# EAGLE design Multi Room Fire Detection (EAGLE 9.6.2)
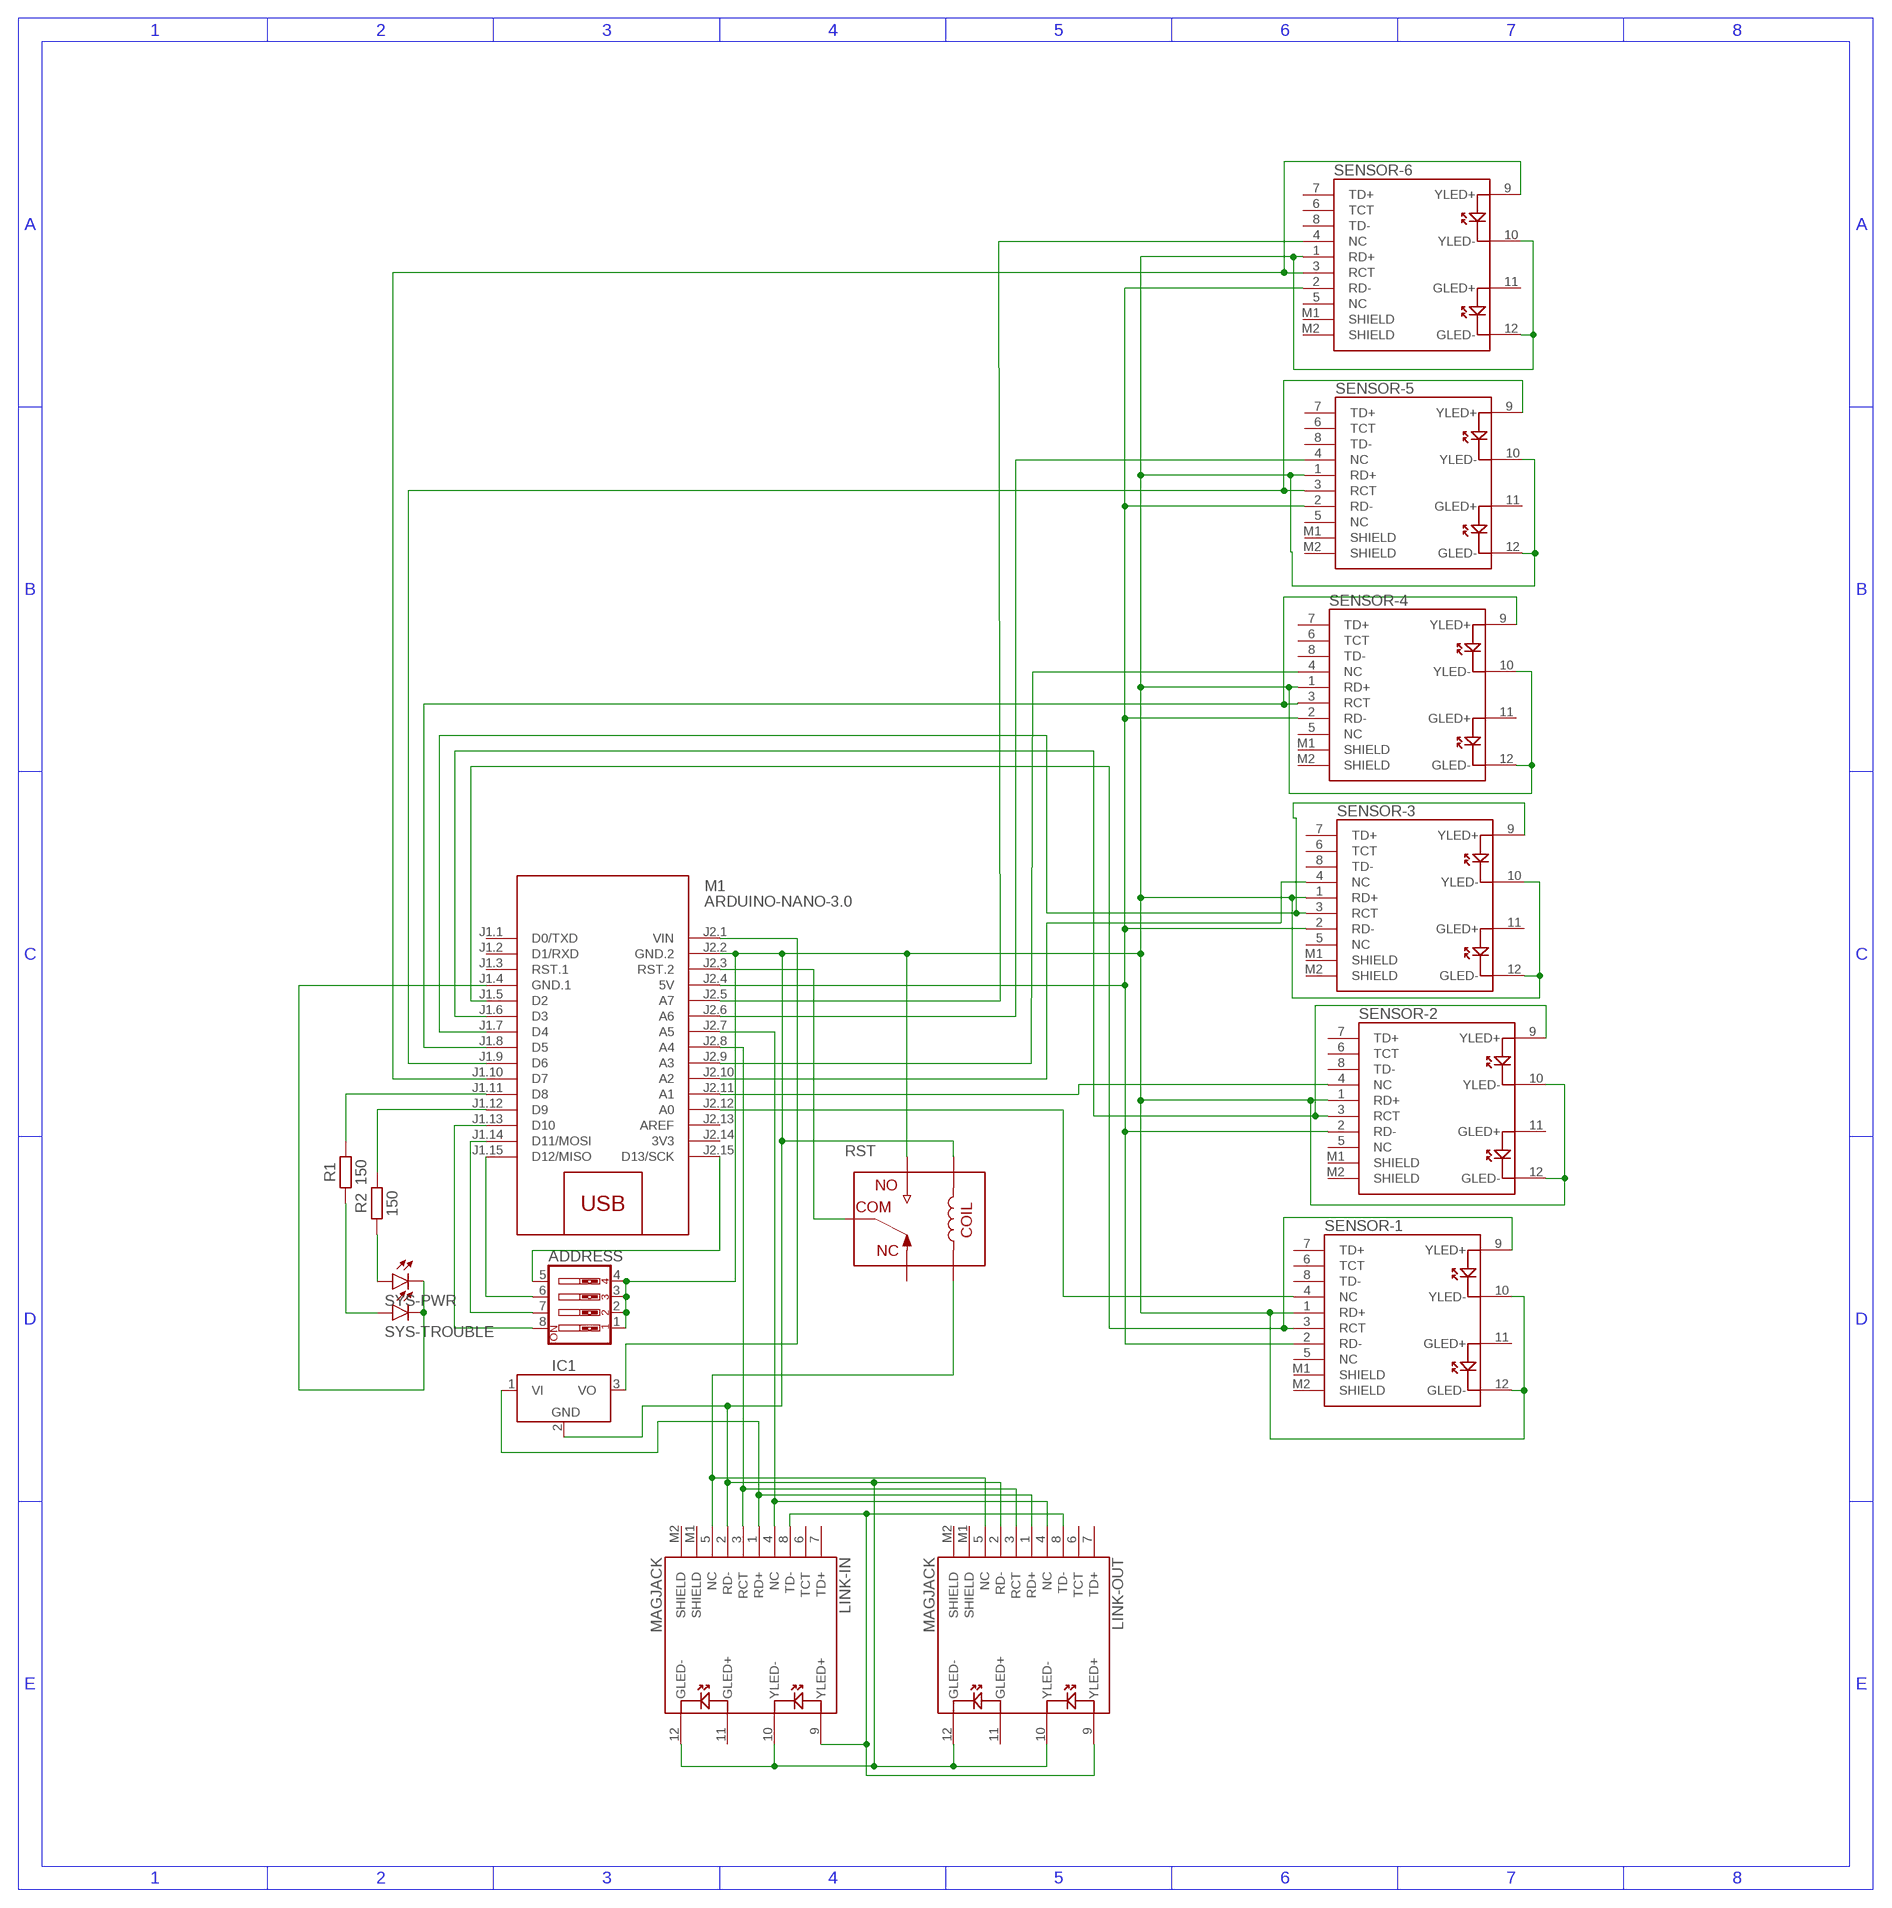
[diagram p0: schematic, sheet 1]

## Parts
ADDRESS  SW_DIP-4  [EDG-04]
IC1  LM7805_TO220V  [TO220V]
LINK-IN  MAGJACK  [MAGJACK]
LINK-OUT  MAGJACK  [MAGJACK]
M1  ARDUINO-NANO-3.0  [ARDUINO-NANO-3.0]
R1  150  RESISTOR__AXIAL-7.2MM-PITCH  [RESAD724W46L381D178B]
R2  150  RESISTOR__AXIAL-7.2MM-PITCH  [RESAD724W46L381D178B]
RST  ACT112  [ACT112]
SENSOR-1  MAGJACK  [MAGJACK]
SENSOR-2  MAGJACK  [MAGJACK]
SENSOR-3  MAGJACK  [MAGJACK]
SENSOR-4  MAGJACK  [MAGJACK]
SENSOR-5  MAGJACK  [MAGJACK]
SENSOR-6  MAGJACK  [MAGJACK]
SYS-PWR  LED_GREEN  LED_RADIAL_GREEN  [LEDRD254W60D565H860B_G]
SYS-TROUBLE  LED_RED  LED_RADIAL_RED  [LEDRD254W60D565H860B]

## Nets
GND: ADDRESS.1 ADDRESS.2 ADDRESS.3 ADDRESS.4 IC1.2(GND) LINK-IN.2(RD-) LINK-IN.10(YLED-) LINK-IN.12(GLED-) LINK-OUT.2(RD-) LINK-OUT.10(YLED-) LINK-OUT.12(GLED-) M1.J2.2(GND.2) RST.1 RST.4 SENSOR-1.1(RD+) SENSOR-1.10(YLED-) SENSOR-1.12(GLED-) SENSOR-2.1(RD+) SENSOR-2.10(YLED-) SENSOR-2.12(GLED-) SENSOR-3.1(RD+) SENSOR-3.10(YLED-) SENSOR-3.12(GLED-) SENSOR-4.1(RD+) SENSOR-4.10(YLED-) SENSOR-4.12(GLED-) SENSOR-5.1(RD+) SENSOR-5.10(YLED-) SENSOR-5.12(GLED-) SENSOR-6.1(RD+) SENSOR-6.10(YLED-) SENSOR-6.12(GLED-)
N$1: M1.J2.12(A0) SENSOR-1.4(NC)
N$2: M1.J2.11(A1) SENSOR-2.4(NC)
N$3: M1.J2.10(A2) SENSOR-3.4(NC)
N$4: M1.J2.9(A3) SENSOR-4.4(NC)
N$5: M1.J2.6(A6) SENSOR-5.4(NC)
N$6: M1.J2.5(A7) SENSOR-6.4(NC)
N$7: M1.J1.10(D7) SENSOR-6.3(RCT) SENSOR-6.9(YLED+)
N$8: M1.J1.9(D6) SENSOR-5.3(RCT) SENSOR-5.9(YLED+)
N$9: M1.J1.8(D5) SENSOR-4.3(RCT) SENSOR-4.9(YLED+)
N$10: M1.J1.7(D4) SENSOR-3.3(RCT) SENSOR-3.9(YLED+)
N$11: M1.J1.6(D3) SENSOR-2.3(RCT) SENSOR-2.9(YLED+)
N$12: M1.J1.5(D2) SENSOR-1.3(RCT) SENSOR-1.9(YLED+)
N$13: M1.J2.4(5V) SENSOR-1.2(RD-) SENSOR-2.2(RD-) SENSOR-3.2(RD-) SENSOR-4.2(RD-) SENSOR-5.2(RD-) SENSOR-6.2(RD-)
N$15: M1.J2.3(RST.2) RST.2
N$17: LINK-IN.3(RCT) LINK-OUT.3(RCT) M1.J2.8(A4)
N$18: LINK-IN.4(NC) LINK-OUT.4(NC) M1.J2.7(A5)
N$19: LINK-IN.5(NC) LINK-OUT.5(NC) RST.5
N$20: M1.J1.11(D8) R1.2
N$21: M1.J1.12(D9) R2.2
N$22: R1.1 SYS-TROUBLE.1(A)
N$23: M1.J1.4(GND.1) SYS-PWR.2(C) SYS-TROUBLE.2(C)
N$24: R2.1 SYS-PWR.1(A)
N$25: ADDRESS.5 M1.J2.15(D13/SCK)
N$26: ADDRESS.6 M1.J1.15(D12/MISO)
N$27: ADDRESS.7 M1.J1.14(D11/MOSI)
N$28: ADDRESS.8 M1.J1.13(D10)
N$29: LINK-IN.8(TD-) LINK-IN.9(YLED+) LINK-OUT.8(TD-) LINK-OUT.9(YLED+)
VI: IC1.1(VI) LINK-IN.1(RD+) LINK-OUT.1(RD+)
VO: IC1.3(VO) M1.J2.1(VIN)
Unconnected: LINK-IN.6(TCT) LINK-IN.7(TD+) LINK-IN.11(GLED+) LINK-IN.M1(SHIELD) LINK-IN.M2(SHIELD) LINK-OUT.6(TCT) LINK-OUT.7(TD+) LINK-OUT.11(GLED+) LINK-OUT.M1(SHIELD) LINK-OUT.M2(SHIELD) M1.J1.1(D0/TXD) M1.J1.2(D1/RXD) M1.J1.3(RST.1) M1.J2.13(AREF) RST.3 SENSOR-1.5(NC) SENSOR-1.6(TCT) SENSOR-1.7(TD+) SENSOR-1.8(TD-) SENSOR-1.11(GLED+) SENSOR-1.M1(SHIELD) SENSOR-1.M2(SHIELD) SENSOR-2.5(NC) SENSOR-2.6(TCT) SENSOR-2.7(TD+) SENSOR-2.8(TD-) SENSOR-2.11(GLED+) SENSOR-2.M1(SHIELD) SENSOR-2.M2(SHIELD) SENSOR-3.5(NC) SENSOR-3.6(TCT) SENSOR-3.7(TD+) SENSOR-3.8(TD-) SENSOR-3.11(GLED+) SENSOR-3.M1(SHIELD) SENSOR-3.M2(SHIELD) SENSOR-4.5(NC) SENSOR-4.6(TCT) SENSOR-4.7(TD+) SENSOR-4.8(TD-) SENSOR-4.11(GLED+) SENSOR-4.M1(SHIELD) SENSOR-4.M2(SHIELD) SENSOR-5.5(NC) SENSOR-5.6(TCT) SENSOR-5.7(TD+) SENSOR-5.8(TD-) SENSOR-5.11(GLED+) SENSOR-5.M1(SHIELD) SENSOR-5.M2(SHIELD) SENSOR-6.5(NC) SENSOR-6.6(TCT) SENSOR-6.7(TD+) SENSOR-6.8(TD-) SENSOR-6.11(GLED+) SENSOR-6.M1(SHIELD) SENSOR-6.M2(SHIELD)

## Power pins joined to a net without a drawn wire
3V3: M1.J2.14(3V3)

## Library data of the parts
ADDRESS = special:SW_DIP-4: DIP SWITCH
IC1 = Tinkercad:LM7805: 5V Voltage Regulator Reference Datasheet <https://www.ti.com/lit/ds/symlink/lm340.pdf>
LINK-IN LINK-OUT SENSOR-1-SENSOR-6 = SparkFun-Connectors:MAGJACK: MAGJACK: RJ-45 with LEDs This is a single port, RJ45 ethernet jacks with built in transformer (magnetics), status LEDs, and shielding. Here is the connector we sell at SparkFun: RJ45 Ethernet MagJack-Compatible <https://www.sparkfun.com/products/8534> (PRT-08534) Datasheet <http://www.sparkfun.com/datasheets/Prototyping/MagJack.pdf> It is used on this SparkFun product: SparkFun RJ45 MagJack Breakout <https://www.sparkfun.com/products/13021> (BOB-13021); PROD_ID: CONN-09556; SF_ID: PRT-08534
M1 = diy-modules-2:ARDUINO-NANO-3.0: Arduino Nano 3.0
R1 R2 = Tinkercad:RESISTOR: Resistor Fixed - Generic; CATEGORY: Resistor; SUB-CATEGORY: Fixed
RST = Relay:ACT112: RELAY AUTOMOTIVE SPDT 20A 12V Manufacturer's datasheet <https://www.panasonic-electric-works.com/pew/eu/downloads/ds_61205_en_ct.pdf>; CREATED_BY: PCBLayout.com; DIGIKEY_PARTNO: 255-2591-ND; MANUFACTURER: Panasonic Electric Works; MPN: ACT112
SYS-PWR SYS-TROUBLE = Tinkercad:LED_RADIAL: LED - Generic; CATEGORY: Opto-Electronic; SUB-CATEGORY: LED

## Board
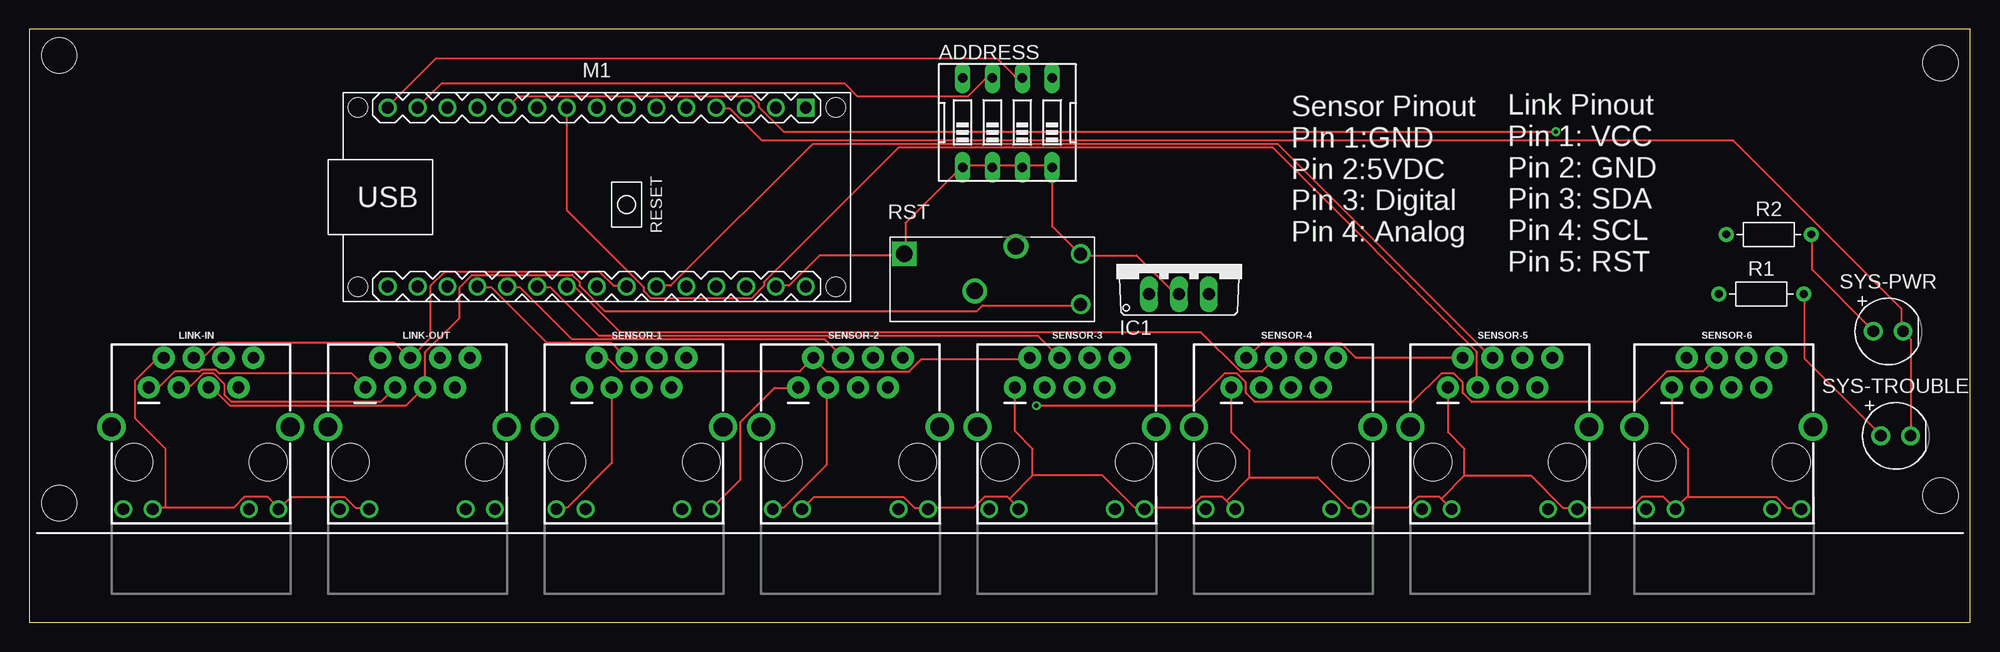
[diagram p1: board, top side]
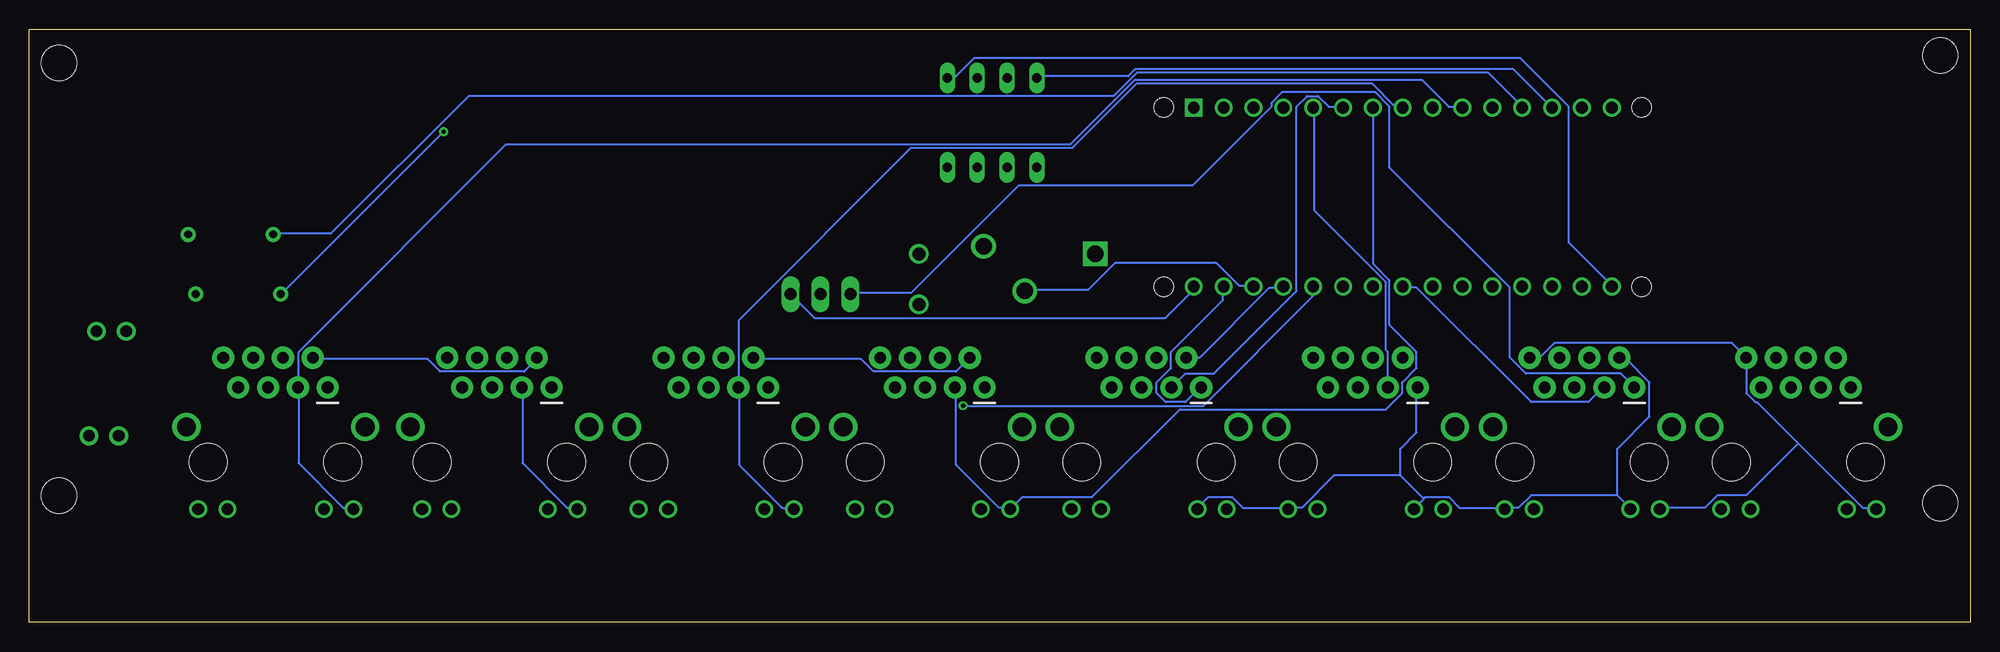
[diagram p2: board, bottom side, seen from below]

Size 165.08 x 50.47 mm. Coordinates in mm from the lower left corner, seen from the top.
Outline: 0,0 165.08,0 165.08,50.47 0,50.47 0,0
Copper layers (1*16): Top 0.035mm / dielectric 0.15mm / Bottom 0.035mm
Design rules "default": minimum track width 6mil, minimum drill 0.35mm, track to track 6mil, track to pad 6mil, pad to pad 6mil, via to via 6mil, smd to smd 6mil, copper to edge 40mil, drill to drill 6mil, minimum pad ring 10mil, minimum via ring 8mil, stop-mask expansion 4mil, vias tented up to drill 0mil, thermal gap 10mil
Holes 3 mm at 2.54,48.26 2.54,10.16 162.56,10.79 162.56,47.62

### Footprints (pad centres in the part's own frame; a part is rotated, then mirrored left to right if it is on the bottom)
EDG-04 = drill 0.813 long: 1 -3.81,-3.81; 2 -1.27,-3.81; 3 1.27,-3.81; 4 3.81,-3.81; 5 3.81,3.81; 6 1.27,3.81; 7 -1.27,3.81; 8 -3.81,3.81
TO220V = drill 1.016 long: 1 -2.54,-2.54; 2 0,-2.54; 3 2.54,-2.54
MAGJACK = drill 1 pad 1.88: 1 3.175,17.445; 2 4.445,19.985; 3 5.715,17.445; 4 6.985,19.985; 5 8.255,17.445; 6 9.525,19.985; 7 10.795,17.445; 8 12.065,19.985 | drill 1 pad 1.27: 9 1,7.1; 10 3.5,7.1; 11 11.7,7.1; 12 14.2,7.1 | drill 1.6 pad 2.184: M1 0,14.1; M2 15.2,14.1 | hole 3.2: 1.905,11.095; 13.335,11.095
ARDUINO-NANO-3.0 = drill 1 square: J1.1 17.78,7.62 | drill 1: J1.2 15.24,7.62; J1.3 12.7,7.62; J1.4 10.16,7.62; J1.5 7.62,7.62; J1.6 5.08,7.62; J1.7 2.54,7.62; J1.8 0,7.62; J1.9 -2.54,7.62; J1.10 -5.08,7.62; J1.11 -7.62,7.62; J1.12 -10.16,7.62; J1.13 -12.7,7.62; J1.14 -15.24,7.62; J1.15 -17.78,7.62; J2.1 17.78,-7.62; J2.2 15.24,-7.62; J2.3 12.7,-7.62; J2.4 10.16,-7.62; J2.5 7.62,-7.62; J2.6 5.08,-7.62; J2.7 2.54,-7.62; J2.8 0,-7.62; J2.9 -2.54,-7.62; J2.10 -5.08,-7.62; J2.11 -7.62,-7.62; J2.12 -10.16,-7.62; J2.13 -12.7,-7.62; J2.14 -15.24,-7.62; J2.15 -17.78,-7.62 | hole 1.651: -20.32,7.62; -20.32,-7.62; 20.32,-7.62; 20.32,7.62
RESAD724W46L381D178B = drill 0.66 pad 1.26: 1 -3.62,0; 2 3.62,0
ACT112 = drill 1.4 square: 1 -7.5,2.15 | drill 1.4: 2 -1.5,-1; 3 2,2.8 | drill 1.1: 4 7.5,2.15; 5 7.5,-2.15
LEDRD254W60D565H860B_G = drill 0.981 pad 1.581: 1 -1.27,0; 2 1.27,0
LEDRD254W60D565H860B = drill 0.981 pad 1.581: 1 -1.27,0; 2 1.27,0

### Placement (x,y rotation side)
ADDRESS  83.19,42.54 0 top
IC1  97.79,30.48 0 top
LINK-IN  6.99,2.54 0 top
LINK-OUT  25.4,2.54 0 top
M1  48.26,36.2 0 top
R1  147.32,27.94 180 top
R2  147.96,33.02 180 top
RST  81.92,29.21 0 top
SENSOR-1  43.81,2.54 0 top
SENSOR-2  62.23,2.54 0 top
SENSOR-3  80.64,2.54 0 top
SENSOR-4  99.06,2.54 0 top
SENSOR-5  117.47,2.54 0 top
SENSOR-6  136.53,2.54 0 top
SYS-PWR  158.12,24.77 0 top
SYS-TROUBLE  158.75,15.88 0 top

### Tracks (layer width: path | path; a pad name or v marks a point on that pad's centre or on a via)
GND
  Top 0.152: 141.12,10.67 140.97,10.67 140.06,9.75 SENSOR-6.10 139.9,9.75 138.99,10.67 137.16,10.67 136.25,9.75 131.83,9.75 SENSOR-5.12 131.67,9.75 130.45,9.75 127.71,12.5 122.07,12.5 | 141.12,10.67 148.59,10.67 149.5,9.75 150.72,9.75 SENSOR-6.12 | 141.12,10.67 141.12,14.78 139.75,16.15 139.75,19.96 SENSOR-6.1 | 120.09,10.52 120.85,9.75 SENSOR-5.10 | 120.09,10.52 119.94,10.67 118.11,10.67 117.2,9.75 113.39,9.75 SENSOR-4.12 113.23,9.75 112.17,9.75 109.58,12.34 103.78,12.34 | 122.07,12.5 122.07,14.78 120.7,16.15 120.7,19.96 SENSOR-5.1 | 120.09,10.52 122.07,12.5 | 83.36,10.52 84.12,9.75 SENSOR-3.10 | 83.36,10.52 83.21,10.67 81.23,10.67 80.31,9.75 76.5,9.75 SENSOR-2.12 76.35,9.75 75.29,9.75 74.37,10.67 66.75,10.67 65.84,9.75 SENSOR-2.10 | SENSOR-3.1 83.82,16.31 85.34,14.78 85.34,12.5 | 83.36,10.52 85.34,12.5 | 101.8,10.36 102.41,9.75 SENSOR-4.10 | 101.8,10.36 101.5,10.67 99.67,10.67 98.75,9.75 94.94,9.75 SENSOR-3.12 94.79,9.75 94.03,9.75 91.29,12.5 85.34,12.5 | 103.78,12.34 103.78,14.63 102.26,16.15 102.26,19.96 SENSOR-4.1 | 101.8,10.36 103.78,12.34 | M1.J2.2 63.55,28.65 64.62,28.65 67.21,31.24 74.37,31.24 RST.1 74.52,31.39 74.52,33.98 79.25,38.71 ADDRESS.1 79.4,38.86 81.84,38.86 ADDRESS.2 81.99,38.86 84.43,38.86 ADDRESS.3 84.58,38.86 86.87,38.86 ADDRESS.4 87.02,38.71 87.02,33.68 89.31,31.39 RST.4 89.46,31.24 94.18,31.24 97.38,28.04 97.69,28.04 IC1.2 | SENSOR-2.1 65.38,19.96 63.4,19.96 60.5,17.07 60.5,12.19 58.06,9.75 SENSOR-1.12 | 11.58,9.75 17.37,9.75 18.29,10.67 20.27,10.67 21.18,9.75 LINK-IN.12 21.34,9.75 22.25,10.67 26.82,10.67 27.74,9.75 28.8,9.75 LINK-OUT.10
  Top 0.152: 11.58,9.75 10.52,9.75 LINK-IN.10 | 11.58,9.75 11.58,14.78 8.99,17.37 8.99,20.57 10.82,22.4 11.43,22.4 LINK-IN.2
  Bottom 0.152: SENSOR-2.10 65.68,9.75 64.77,10.67 62.79,10.67 61.87,9.75 58.06,9.75 SENSOR-1.12 57.91,9.75 56.84,9.75 54.1,12.5 48.46,12.5 | 46.48,10.52 47.24,9.75 SENSOR-1.10 | 46.48,10.52 46.33,10.67 44.35,10.67 43.43,9.75 39.62,9.75 LINK-OUT.12 39.47,9.75 38.41,9.75 37.34,10.82 30.02,10.82 | 48.46,12.5 48.46,14.78 47.09,16.15 47.09,19.96 SENSOR-1.1 | 46.48,10.52 48.46,12.5 | 30.02,10.82 30.02,14.78 27.28,17.53 27.28,20.42 29.26,22.4 29.72,22.4 LINK-OUT.2 | 30.02,10.82 28.96,9.75 LINK-OUT.10 | M1.J2.2 63.55,28.5 63.55,27.43 67.97,23.01 67.97,21.64 69.19,20.42 69.19,19.51 68.43,18.75 66.75,18.75 65.53,19.96 SENSOR-2.1
N$1
  Top 0.152: M1.J2.12 38.1,28.5 39.32,28.5 44.04,23.77 49.53,23.77 50.75,22.55 SENSOR-1.4
N$2
  Top 0.152: M1.J2.11 40.69,28.5 41.76,28.5 46.18,24.08 67.67,24.08 69.19,22.55 SENSOR-2.4
N$3
  Top 0.152: M1.J2.10 43.28,28.5 44.35,28.5 48.46,24.38 85.8,24.38 87.63,22.55 SENSOR-3.4
N$4
  Top 0.152: M1.J2.9 45.72,28.5 46.48,28.5 50.29,24.69 99.67,24.69 103.02,21.34 104.85,21.34 105.92,22.4 SENSOR-4.4
N$5
  Top 0.152: M1.J2.6 53.34,28.65 54.56,28.65 66.6,40.69 106.22,40.69 124.36,22.55 SENSOR-5.4
N$6  (via drill 0.35)
  Top 0.152: v85.65,18.44 98.91,18.44 101.65,21.18 102.72,21.18 103.48,20.42 103.48,19.51 104.24,18.75 117.65,18.75 120.09,21.18 121.16,21.18 121.92,20.42 121.92,19.51 122.68,18.75 136.7,18.75 139.29,21.34 142.34,21.34 143.41,22.4 SENSOR-6.4
  Bottom 0.152: v85.65,18.44 65.23,18.44 55.93,27.74 55.93,28.5 M1.J2.5
N$7
  Bottom 0.152: SENSOR-6.9 137.62,9.75 138.38,9.75 142.19,13.56 142.19,19.96 SENSOR-6.3 142.19,20.12 142.19,23.01 124.51,40.69 76.5,40.69 71.02,46.18 46.63,46.18 44.35,43.89 43.28,43.89 M1.J1.10
N$8
  Top 0.152: M1.J1.9 45.72,35.05 52.27,28.5 52.27,28.19 52.88,27.58 61.42,27.58 62.48,28.65 62.48,28.96 73.91,40.39 105.77,40.39 123.14,23.01 123.14,20.12 SENSOR-5.3
  Bottom 0.152: SENSOR-5.9 118.57,9.75 119.33,9.75 123.14,13.56 123.14,19.96 SENSOR-5.3
N$9
  Bottom 0.152: SENSOR-4.9 100.13,9.75 101.04,9.75 104.7,13.41 104.7,19.96 SENSOR-4.3 104.7,20.12 104.7,25.76 90.07,40.39 76.35,40.39 70.87,45.87 50.9,45.87 48.92,43.89 48.31,43.89 M1.J1.8
N$10
  Bottom 0.152: M1.J1.7 50.75,43.74 50.75,30.48 49.38,29.11 49.38,25.3 47.09,23.01 47.09,21.64 48.31,20.42 48.31,19.51 49.68,18.14 67.21,18.14 74.68,10.67 80.62,10.67 81.53,9.75 SENSOR-3.9 81.69,9.75 82.6,9.75 86.26,13.41 86.26,19.96 SENSOR-3.3
N$11
  Top 0.152: SENSOR-2.9 63.25,9.75 64.16,9.75 67.82,13.41 67.82,19.96 SENSOR-2.3
  Bottom 0.152: M1.J1.6 53.34,43.89 54.56,43.89 55.47,44.81 56.39,44.81 57.3,43.89 57.3,28.19 64.31,21.18 66.75,21.18 67.82,20.12 SENSOR-2.3
N$12
  Top 0.152: SENSOR-1.3 49.53,13.56 45.72,9.75 44.96,9.75 SENSOR-1.9
  Bottom 0.152: SENSOR-1.3 49.53,23.01 49.68,23.16 49.68,28.96 55.78,35.05 55.78,43.74 M1.J1.5
N$13
  Top 0.152: SENSOR-1.2 48.31,22.4 49.23,22.4 50.29,21.34 65.53,21.34 66.6,22.4 SENSOR-2.2 66.75,22.4 67.82,21.34 74.83,21.34 75.89,22.4 85.04,22.4 SENSOR-3.2 | SENSOR-5.2 121.92,22.55 112.78,22.55 111.56,23.77 104.85,23.77 103.63,22.55 SENSOR-4.2
  Bottom 0.152: M1.J2.4 58.52,28.5 59.59,28.5 65.53,22.55 66.6,22.55 SENSOR-2.2 | SENSOR-4.2 103.48,22.4 94.34,22.4 93.27,21.34 86.26,21.34 85.19,22.4 SENSOR-3.2 | SENSOR-6.2 140.97,22.4 131.22,22.4 130.15,21.34 122.99,21.34 121.92,22.4 SENSOR-5.2
N$15
  Bottom 0.152: M1.J2.3 60.96,28.65 62.18,28.65 64.16,30.63 72.69,30.63 74.98,28.35 80.31,28.35 RST.2
N$17
  Top 0.152: LINK-IN.3 12.8,20.12 13.72,20.12 14.78,21.18 15.7,21.18 16.61,20.27 16.61,19.36 17.22,18.75 29.87,18.75 31.09,19.96 LINK-OUT.3
  Bottom 0.152: M1.J2.8 48.16,28.5 47.09,28.5 37.34,18.75 32.46,18.75 31.24,19.96 LINK-OUT.3
N$18
  Top 0.152: M1.J2.7 50.75,28.65 49.68,28.65 48.46,29.87 35.36,29.87 34.14,28.65 34.14,24.23 32.46,22.55 LINK-OUT.4 32.31,22.55 31.09,23.77 16,23.77 14.78,22.55 14.02,22.55 LINK-IN.4
N$19
  Top 0.152: RST.5 89.31,26.98 81.08,26.98 80.62,26.52 48.92,26.52 46.79,28.65 46.79,28.96 46.18,29.57 37.64,29.57 36.58,28.5 36.58,25.91 33.68,23.01 33.68,20.12 LINK-OUT.5 33.53,19.96 32,18.44 17.07,18.44 15.54,19.96 15.24,19.96 LINK-IN.5
N$20  (via drill 0.35)
  Top 0.152: v129.84,41.76 64.16,41.76 62.03,43.89 62.03,44.2 61.42,44.81 41.6,44.81 40.69,43.89 M1.J1.11
  Bottom 0.152: v129.84,41.76 143.56,28.04 R1.2
N$21
  Bottom 0.152: R2.2 144.32,33.07 139.45,33.07 127.71,44.81 72.85,44.81 70.87,46.79 41,46.79 38.1,43.89 M1.J1.12
N$22
  Top 0.152: R1.1 151.03,27.89 151.03,22.4 157.43,16 SYS-TROUBLE.1
N$23
  Top 0.152: M1.J1.4 58.52,43.74 59.59,43.74 62.33,41 144.93,41 159.26,26.67 159.26,24.84 SYS-PWR.2 159.41,24.69 160.02,24.08 SYS-TROUBLE.2
N$24
  Top 0.152: R2.1 151.64,32.92 151.64,30.02 156.82,24.84 SYS-PWR.1
N$25
  Bottom 0.152: ADDRESS.5 86.87,46.48 86.26,46.48 84.73,48.01 38.25,48.01 34.14,43.89 34.14,32.31 30.48,28.65 M1.J2.15
N$26
  Top 0.152: ADDRESS.6 84.43,46.48 83.82,46.48 82.3,48.01 34.59,48.01 30.48,43.89 M1.J1.15
N$27
  Top 0.152: ADDRESS.7 81.84,46.33 81.38,46.33 79.86,44.81 70.41,44.81 69.34,45.87 35.05,45.87 33.07,43.89 M1.J1.14
N$28
  Bottom 0.152: ADDRESS.8 79.25,46.48 71.63,46.48 71.02,47.09 38.86,47.09 35.66,43.89 M1.J1.13
N$29
  Bottom 0.152: 14.63,15.24 18.14,18.75 18.29,18.75 19.05,19.51 LINK-IN.8 19.05,22.55 20.27,23.77 35.36,23.77 36.58,22.55 37.34,22.55 LINK-OUT.8 | 14.63,15.24 9.14,9.75 8.08,9.75 LINK-IN.9 | 14.63,15.24 19.05,10.82 21.49,10.82 22.55,9.75 26.36,9.75 LINK-OUT.9
VI
  Top 0.152: LINK-IN.1 10.21,20.12 11.12,20.12 12.34,21.34 14.48,21.34 14.63,21.49 15.85,21.49 16.15,21.18 27.43,21.18 28.5,20.12 LINK-OUT.1
  Bottom 0.152: IC1.1 95.25,28.04 90.07,28.04 80.92,37.19 66.14,37.19 59.44,43.89 59.44,44.2 58.52,45.11 50.6,45.11 49.38,43.89 49.38,38.71 39.17,28.5 39.17,22.55 37.8,21.18 29.72,21.18 28.65,20.12 LINK-OUT.1
VO
  Bottom 0.152: IC1.3 98.3,25.91 68.43,25.91 66.14,28.19 66.14,28.5 M1.J2.1

### Text on the board
tNames: Sensor Pinout / PIn 1:GND / Pin 2:5VDC / Pin 3: Digital / Pin 4: Analog | Link Pinout / Pin 1: VCC / Pin 2: GND / Pin 3: SDA / Pin 4: SCL / Pin 5: RST